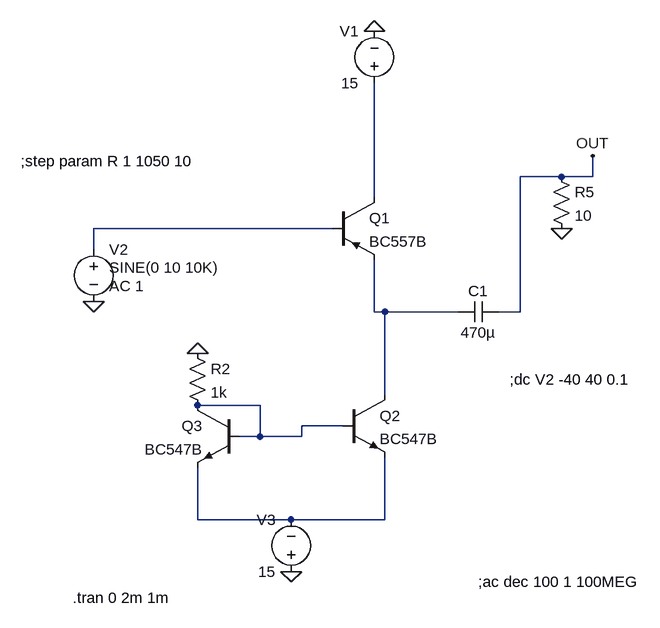
[diagram p0: schematic final_class_A.asc]
final_class_A.asc, the LTspice schematic file:
Version 4
SHEET 1 880 728
WIRE 576 64 512 64
WIRE 624 64 624 32
WIRE 624 64 576 64
WIRE 288 96 288 -80
WIRE 224 144 -144 144
WIRE -144 176 -144 144
WIRE 288 272 288 192
WIRE 304 272 288 272
WIRE 416 272 304 272
WIRE 512 272 512 64
WIRE 512 272 480 272
WIRE 304 400 304 272
WIRE 112 416 16 416
WIRE 240 448 176 448
WIRE 112 464 112 416
WIRE 112 464 80 464
WIRE 176 464 176 448
WIRE 176 464 112 464
WIRE 16 592 16 512
WIRE 160 592 16 592
WIRE 304 592 304 496
WIRE 304 592 160 592
FLAG 288 -160 0
FLAG 624 32 OUT
FLAG -144 256 0
FLAG 576 144 0
FLAG 160 672 0
FLAG 16 336 0
DATAFLAG 176 144 "$-V(N002)"
SYMBOL voltage 288 -64 R180
WINDOW 0 24 96 Left 2
WINDOW 3 24 16 Left 2
WINDOW 123 0 0 Left 0
WINDOW 39 0 0 Left 0
SYMATTR InstName V1
SYMATTR Value 15
SYMBOL voltage -144 160 R0
WINDOW 123 24 72 Left 2
WINDOW 39 0 0 Left 0
WINDOW 3 24 44 Left 2
SYMATTR Value2 AC 1
SYMATTR Value SINE(0 10 10K)
SYMATTR InstName V2
SYMBOL res 560 48 R0
SYMATTR InstName R5
SYMATTR Value 10
SYMBOL npn 240 400 R0
SYMATTR InstName Q2
SYMATTR Value BC547B
SYMBOL npn 80 416 M0
SYMATTR InstName Q3
SYMATTR Value BC547B
SYMBOL voltage 160 688 R180
WINDOW 0 24 96 Left 2
WINDOW 3 24 16 Left 2
WINDOW 123 0 0 Left 0
WINDOW 39 0 0 Left 0
SYMATTR InstName V3
SYMATTR Value 15
SYMBOL res 0 320 R0
SYMATTR InstName R2
SYMATTR Value 1k
SYMBOL pnp 224 96 R0
SYMATTR InstName Q1
SYMATTR Value BC557B
SYMBOL cap 480 256 R90
WINDOW 0 0 32 VBottom 2
WINDOW 3 32 32 VTop 2
SYMATTR InstName C1
SYMATTR Value 470µ
TEXT 496 376 Left 2 !;dc V2 -40 40 0.1
TEXT 448 688 Left 2 !;ac dec 100 1 100MEG
TEXT -176 712 Left 2 !.tran 0 2m 1m
TEXT -256 40 Left 2 !;step param R 1 1050 10

The netlist it stands for:
* final_class_A.asc
V1 N001 0 15
V2 N002 0 SINE(0 10 10K) AC 1
R5 OUT 0 10
Q2 N003 N004 N005 0 BC547B
Q3 N004 N004 N005 0 BC547B
V3 0 N005 15
R2 0 N004 1k
Q1 N001 N002 N003 0 BC557B
C1 OUT N003 470µ
.model NPN NPN
.model PNP PNP
.lib standard.bjt
;dc V2 -40 40 0.1
;ac dec 100 1 100MEG
.tran 0 2m 1m
;step param R 1 1050 10
.backanno
.end